# EAGLE design motor_board (EAGLE 6.5.0)
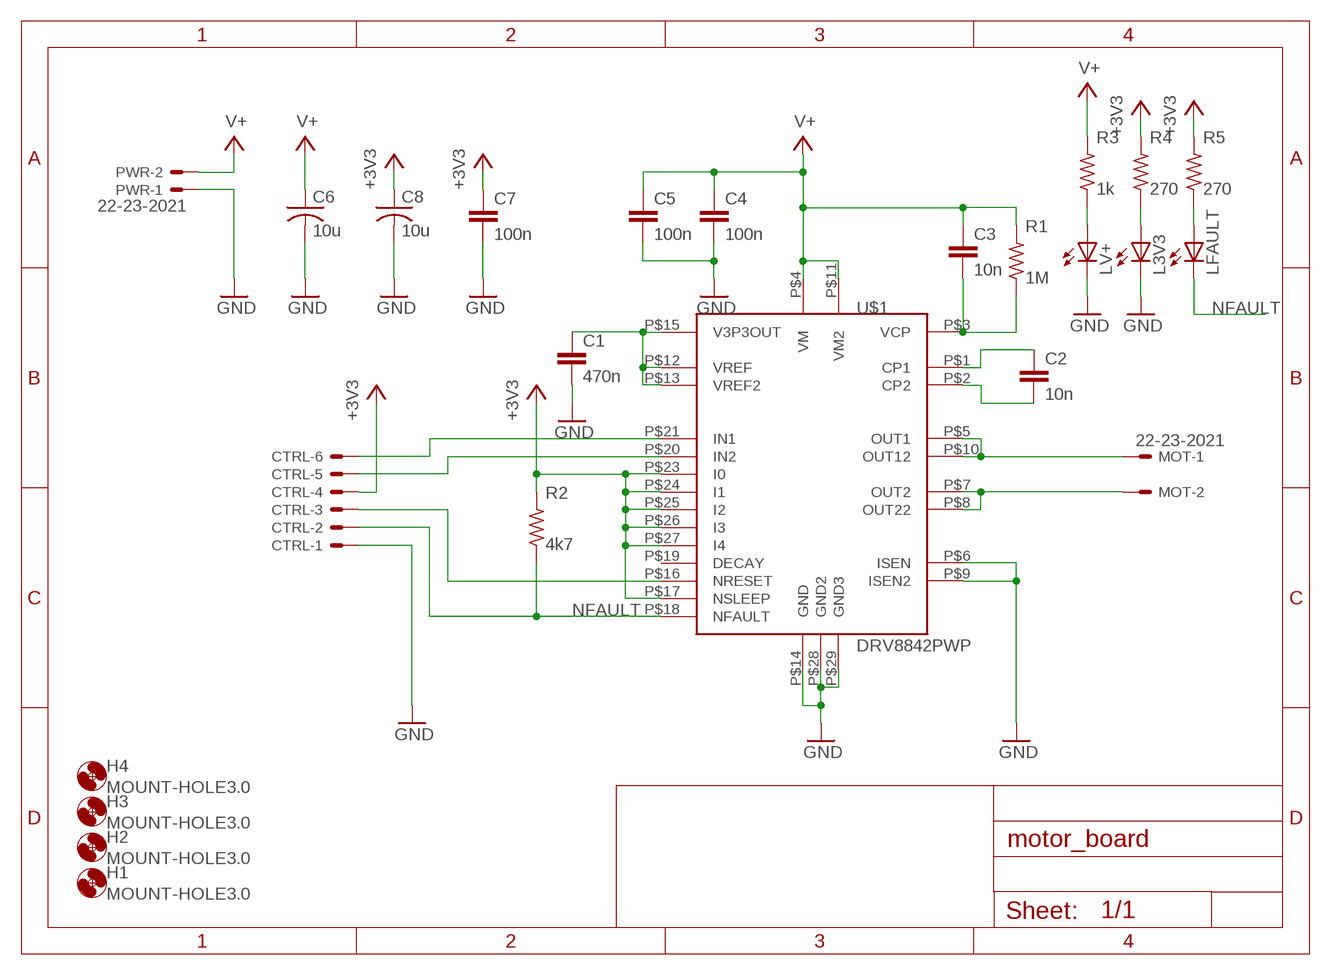
[diagram p0: schematic, sheet 1]

## Parts
C1  470n  C-EUC0603K  [C0603K]
C2  10n  C-EUC0603K  [C0603K]
C3  10n  C-EUC0603K  [C0603K]
C4  100n  C-EUC0603K  [C0603K]
C5  100n  C-EUC0603K  [C0603K]
C6  10u  C-USC0805K  [C0805K]
C7  100n  C-EUC0603K  [C0603K]
C8  10u  C-USC0805K  [C0805K]
CTRL  22-23-2061  [22-23-2061]
H1  MOUNT-HOLE3.0  [3,0]
H2  MOUNT-HOLE3.0  [3,0]
H3  MOUNT-HOLE3.0  [3,0]
H4  MOUNT-HOLE3.0  [3,0]
L3V3  LEDCHIPLED_0603  [CHIPLED_0603]
LFAULT  LEDCHIPLED_0603  [CHIPLED_0603]
LV+  LEDCHIPLED_0603  [CHIPLED_0603]
MOT  22-23-2021  [22-23-2021]
PWR  22-23-2021  [22-23-2021]
R1  1M  R-US_R0603  [R0603]
R2  4k7  R-US_R0603  [R0603]
R3  1k  R-US_R0603  [R0603]
R4  270  R-US_R0603  [R0603]
R5  270  R-US_R0603  [R0603]
U$1  DRV8842PWP  [R-PDS0-G28]

## Nets
+3V3: C7.1 C8.1 CTRL.4 R2.2 R4.2 R5.2 U$1.P$17(NSLEEP) U$1.P$23(I0) U$1.P$24(I1) U$1.P$25(I2) U$1.P$26(I3) U$1.P$27(I4)
CP1: C2.1 U$1.P$1(CP1)
CP2: C2.2 U$1.P$2(CP2)
GND: C1.2 C4.2 C5.2 C6.2 C7.2 C8.2 CTRL.1 L3V3.C LV+.C PWR.1 U$1.P$6(ISEN) U$1.P$9(ISEN2) U$1.P$14(GND) U$1.P$28(GND2) U$1.P$29(GND3)
IN1: CTRL.6 U$1.P$21(IN1)
IN2: CTRL.5 U$1.P$20(IN2)
N$1: L3V3.A R4.1
N$2: LV+.A R3.1
N$3: LFAULT.A R5.1
N$6: C1.1 U$1.P$12(VREF) U$1.P$13(VREF2) U$1.P$15(V3P3OUT)
NFAULT: CTRL.2 LFAULT.C R2.1 U$1.P$18(NFAULT)
NRESET: CTRL.3 U$1.P$16(NRESET)
OUT1: MOT.1 U$1.P$5(OUT1) U$1.P$10(OUT12)
OUT2: MOT.2 U$1.P$7(OUT2) U$1.P$8(OUT22)
V+: C3.1 C4.1 C5.1 C6.1 PWR.2 R1.2 R3.2 U$1.P$4(VM) U$1.P$11(VM2)
VCP: C3.2 R1.1 U$1.P$3(VCP)
Unconnected: U$1.P$19(DECAY)

## Library data of the parts
C1-C5 C7 = rcl:C-EU: CAPACITOR, European symbol
C6 C8 = rcl:C-US: CAPACITOR, American symbol
CTRL = con-molex:22-23-2061: .100" (2.54mm) Center Header - 6 Pin; MF: MOLEX; MPN: 22-23-2061; OC_FARNELL: 1462922; OC_NEWARK: 27C1933
H1-H4 = holes:MOUNT-HOLE: MOUNTING HOLE with drill center marker
L3V3 LFAULT LV+ = led:LED: LED OSRAM: - CHIPLED LG R971, LG N971, LY N971, LG Q971, LY Q971, LO R971, LY R971 LH N974, LH R974 LS Q976, LO Q976, LY Q976 LO Q996 - Hyper CHIPLED LW Q18S LB Q993, LB Q99A, LB R99A - SideLED LS A670, LO A670, LY A670, LG A670, LP A670 LB A673, LV A673, LT A673, LW A673 LH A674 LY A675 LS A676, LA A676, LO A676, LY A676, LW A676 LS A679, LY A679, LG A679 - Hyper Micro SIDELED® LS Y876, LA Y876, LO Y876, LY Y876 LT Y87S - SmartLED LW L88C, LW L88S LB L89C, LB L89S, LG L890 LS L89K, LO L89K, LY L89K LS L896, LA L896, LO L896, LY L896 - TOPLED LS T670, LO T670, LY T670, LG T670, LP T670 LSG T670, LSP T670, LSY T670, LOP T670, LYG T670 LG T671, LOG T671, LSG T671 LB T673, LV T673, LT T673, LW T673 LH T674 LS T676, LA T676, LO T676, LY T676, LB T676, LH T676, LSB T676, LW T676 LB T67C, LV T67C, LT T67C, LS T67K, LO T67K, LY T67K, LW E67C LS E67B, LA E67B, LO E67B, LY E67B, LB E67C, LV E67C, LT E67C LW T67C LS T679, LY T679, LG T679 LS T770, LO T770, LY T770, LG T770, LP T770 LB T773, LV T773, LT T773, LW T773 LH T774 LS E675, LA E675, LY E675, LS T675 LS T776, LA T776, LO T776, LY T776, LB T776 LHGB T686 LT T68C, LB T68C - Hyper Mini TOPLED® LB M676 - Mini TOPLED Santana® LG M470 LS M47K, LO M47K, LY M47K Source: http://www.osram.convergy.de LUXEON: - LUMILED® LXK2-PW12-R00, LXK2-PW12-S00, LXK2-PW14-U00, LXK2-PW14-V00 LXK2-PM12-R00, LXK2-PM12-S00, LXK2-PM14-U00 LXK2-PE12-Q00, LXK2-PE12-R00, LXK2-PE12-S00, LXK2-PE14-T00, LXK2-PE14-U00 LXK2-PB12-K00, LXK2-PB12-L00, LXK2-PB12-M00, LXK2-PB14-N00, LXK2-PB14-P00, LXK2-PB14-Q00 LXK2-PR12-L00, LXK2-PR12-M00, LXK2-PR14-Q00, LXK2-PR14-R00 LXK2-PD12-Q00, LXK2-PD12-R00, LXK2-PD12-S00 LXK2-PH12-R00, LXK2-PH12-S00 LXK2-PL12-P00, LXK2-PL12-Q00, LXK2-PL12-R00 Source: www.luxeon.com KINGBRIGHT: KA-3528ASYC Source: www.kingbright.com
MOT PWR = con-molex:22-23-2021: .100" (2.54mm) Center Header - 2 Pin; MF: MOLEX; MPN: 22-23-2021; OC_FARNELL: 1462926; OC_NEWARK: 25C3832
R1-R5 = rcl:R-US_: RESISTOR, American symbol
U$1 = perso:DRV8842PWP

## Board
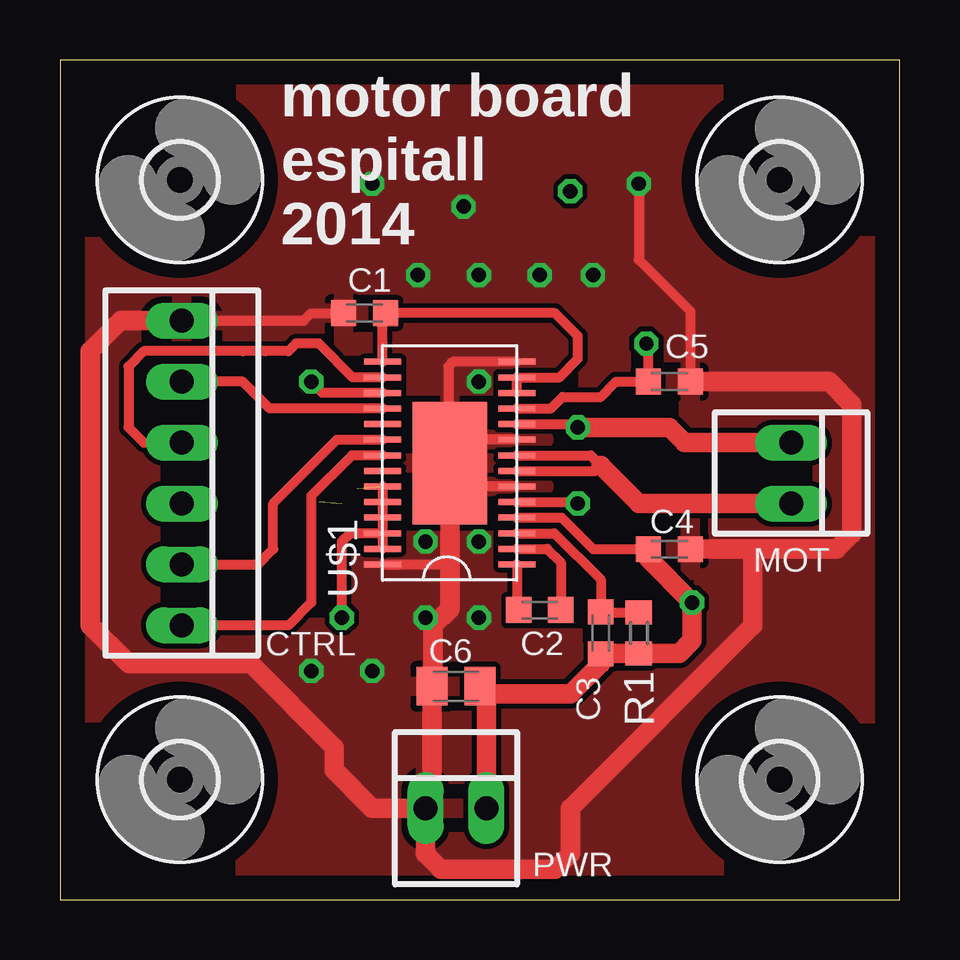
[diagram p1: board, top side]
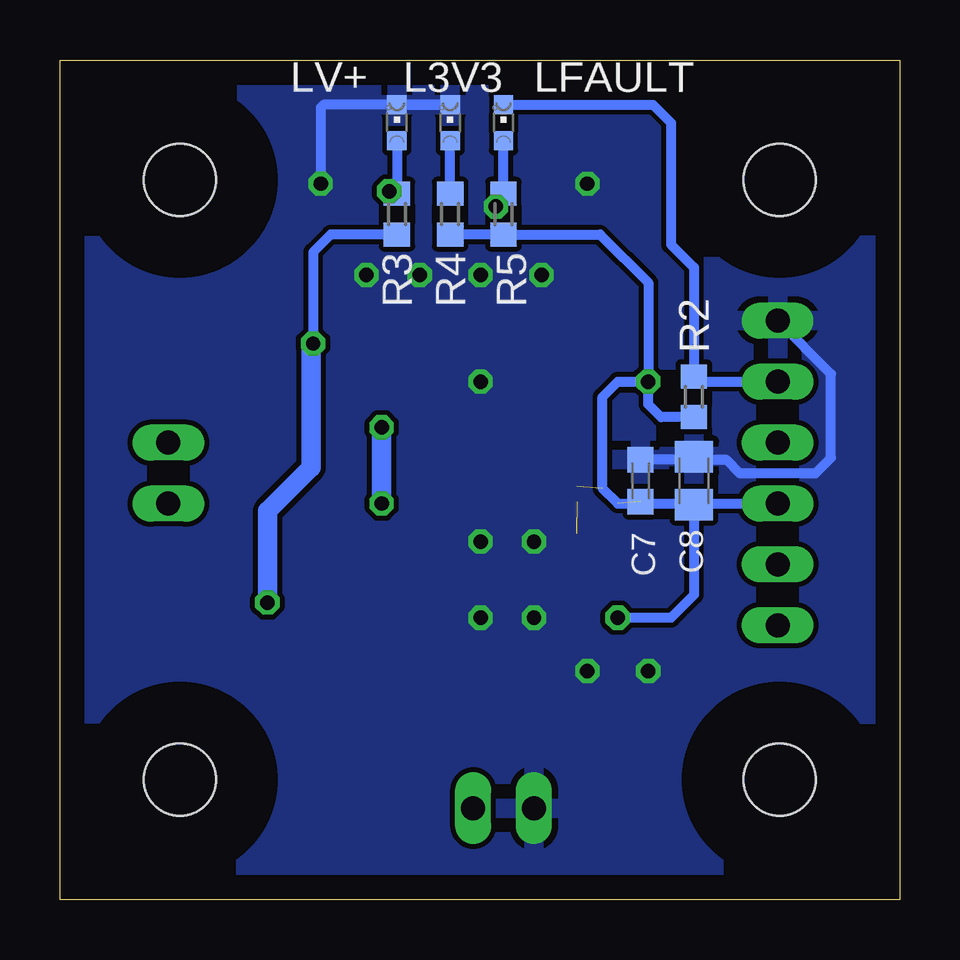
[diagram p2: board, bottom side, seen from below]

Size 35 x 35 mm. Coordinates in mm from the lower left corner, seen from the top.
Outline: 0,0 35,0 35,35 0,35 0,0
Copper layers (1*16): Top 0.035mm / dielectric 1.5mm / Bottom 0.035mm
Design rules "default": minimum track width 10mil, minimum drill 24mil, track to track 8mil, track to pad 8mil, pad to pad 8mil, via to via 8mil, smd to smd 8mil, copper to edge 40mil, drill to drill 8mil, minimum pad ring 10mil, minimum via ring 8mil, stop-mask expansion 4mil, vias tented up to drill 0mil, thermal gap 10mil

### Footprints (pad centres in the part's own frame; a part is rotated, then mirrored left to right if it is on the bottom)
C0603K = smd 1.05 x 1.08: 1 -0.875,0; 2 0.875,0
C0805K = smd 1.3 x 1.6: 1 -1,0; 2 1,0
22-23-2061 = drill 1 long: 1 -6.35,0; 2 -3.81,0; 3 -1.27,0; 4 1.27,0; 5 3.81,0; 6 6.35,0
3,0 = hole 3: 0,0
CHIPLED_0603 = smd 0.8 x 0.8: A 0,-0.75; C 0,0.75
22-23-2021 = drill 1 long: 1 -1.27,0; 2 1.27,0
R0603 = smd 1 x 1.1: 1 -0.85,0; 2 0.85,0
R-PDS0-G28 = smd 0.25 x 1.55: P$1 -3.81,-2.54; P$2 -3.16,-2.54; P$3 -2.51,-2.54; P$4 -1.86,-2.54; P$5 -1.21,-2.54; P$6 -0.56,-2.54; P$7 0.09,-2.54; P$8 0.74,-2.54; P$9 1.39,-2.54; P$10 2.04,-2.54; P$11 2.69,-2.54; P$12 3.34,-2.54; P$13 3.99,-2.54; P$14 4.64,-2.54; P$15 4.64,3.06; P$16 3.99,3.06; P$17 3.34,3.06; P$18 2.69,3.06; P$19 2.04,3.06; P$20 1.39,3.06; P$21 0.74,3.06; P$22 0.09,3.06; P$23 -0.56,3.06; P$24 -1.21,3.06; P$25 -1.86,3.06; P$26 -2.51,3.06; P$27 -3.16,3.06; P$28 -3.81,3.06 | smd 5.1 x 3.1: P$29 0.415,0.26

### Placement (x,y rotation side)
C1  12.7,24.45 180 top
C2  20,12.06 0 top
C3  22.54,11.11 90 top
C4  25.4,14.61 0 top
C5  25.4,21.59 0 top
C6  16.51,8.89 180 top
C7  10.79,17.46 90 bottom
C8  8.57,17.46 90 bottom
CTRL  5.08,17.78 270 top
H1  30,30 0 top
H2  30,5 0 top
H3  5,30 0 top
H4  5,5 0 top
L3V3  18.73,32.38 0 bottom
LFAULT  16.51,32.38 0 bottom
LV+  20.95,32.38 0 bottom
MOT  30.48,17.78 270 top
PWR  16.51,3.81 0 top
R1  24.13,11.11 270 top
R2  8.57,20.95 270 bottom
R3  20.95,28.57 270 bottom
R4  18.73,28.57 270 bottom
R5  16.51,28.57 270 bottom
U$1  16.51,17.78 90 top

### Tracks (layer width: path | path; a pad name or v marks a point on that pad's centre or on a via)
+3V3  (via drill 0.6)  (4 unrouted)
  Top 0.406: U$1.P$17 10.95,21.12 v10.48,21.59 | U$1.P$23 U$1.P$26 | U$1.P$26 U$1.P$27 | U$1.P$26 12.1,15.27 11.75,14.92 v11.75,11.75
  Bottom 0.406: CTRL.4 11.75,16.51 12.38,17.14 12.38,20.95 11.75,21.59 v10.48,21.59 | R2.2 9.95,20.11 10.48,20.64 v10.48,21.59 | C8.1 8.57,12.7 9.53,11.75 v11.75,11.75 | v10.48,21.59 10.48,25.72 12.48,27.73 R5.2 R4.2
CP1
  Top 0.406: U$1.P$1 19.05,12.14 C2.1
CP2
  Top 0.406: U$1.P$2 20.3,14.62 20.88,14.05 C2.2
GND  (via drill 0.6)
  Top 0.406: U$1.P$9 17.23,19.17 U$1.P$29 | U$1.P$6 17.23,17.22 U$1.P$29 | U$1.P$28 16.25,13.97 16.25,13.65 | CTRL.1 10.16,24.13 10.48,24.45 C1.2 | U$1.P$14 16.39,22.42 16.19,22.23 16.19,18.25 U$1.P$29 | v24.13,29.84 24.13,26.67 26.27,24.52 C5.2
  Top 0.813: PWR.1 15.51,4.08 C6.2 15.56,8.94 15.56,11.43 16.25,12.12 16.25,13.65 U$1.P$29 | C5.2 32.07,21.59 33.02,20.64 33.02,15.24 32.38,14.61 28.89,14.61 | 28.89,14.61 C4.2 | CTRL.1 2.54,24.13 1.27,22.86 1.27,11.43 2.86,9.84 7.94,9.84 11.43,6.35 11.43,5.4 13.02,3.81 PWR.1 | PWR.1 15.24,1.91 15.88,1.27 20.64,1.27 21.27,1.91 21.27,3.81 28.89,11.43 28.89,14.61
  Bottom 0.406: 8.7,18.34 C8.2 | 8.7,18.34 7.22,18.34 6.67,17.78 3.49,17.78 2.86,18.41 2.86,21.91 CTRL.1 | 8.7,18.34 C7.2 | LV+.C L3V3.C 24.02,33.13 24.13,33.02 v24.13,29.84
  other vias: 10.48,9.53 13.02,9.53 15.24,11.75 17.46,11.75 15.24,14.92 17.46,14.92 16.83,28.89 17.46,21.59 14.92,26.04 17.46,26.04 20,26.04 22.23,26.04 13.02,29.84
  pour Top: 0,0 34.92,0 34.92,34.92 0,34.92 0,34.61
  pour Bottom: -0.64,-0.95 36.2,-0.95 36.2,36.2 -0.95,36.2
IN1
  Top 0.406: U$1.P$21 12.17,18.52 10.48,16.83 10.48,12.38 9.53,11.43 CTRL.6
IN2
  Top 0.406: CTRL.5 8.26,13.97 8.89,14.61 8.89,16.51 11.55,19.17 U$1.P$20
N$1
  Bottom 0.406: R4.1 L3V3.A
N$2
  Bottom 0.406: LV+.A R3.1
N$3
  Bottom 0.406: R5.1 LFAULT.A
N$6
  Top 0.406: U$1.P$15 13.45,24.32 C1.1 20.64,24.45 21.59,23.5 21.59,22.54 20.82,21.77 U$1.P$13 U$1.P$12
N$18  (via drill 0.6)
  other vias: 21.27,29.53
NFAULT
  Top 0.406: U$1.P$18 8.74,20.47 7.62,21.59 CTRL.2
  Bottom 0.406: 6.99,21.59 CTRL.2 8.36,21.59 R2.1 8.57,26.35 9.53,27.3 9.53,32.38 10.28,33.13 LFAULT.C
NRESET
  Top 0.406: CTRL.3 3.49,19.05 2.86,19.68 2.86,22.23 3.49,22.86 7.62,22.86 8.57,22.86 9.53,22.86 9.84,23.18 10.79,23.18 12.2,21.77 U$1.P$16
OUT1  (via drill 0.6)
  Top 0.406: U$1.P$10 21.45,19.82 v21.59,19.68 | U$1.P$5 21.53,16.57
  Top 0.813: MOT.1 26.04,19.05 25.4,19.68 v21.59,19.68 | 21.53,16.57 v21.59,16.51
  Bottom 0.406: v21.59,19.68 21.59,19.82
  Bottom 0.813: v21.59,19.68 v21.59,16.51
OUT2
  Top 0.406: U$1.P$7 22.32,17.87 22.54,18.1 22.12,18.52 U$1.P$8
  Top 0.813: MOT.2 24.13,16.51 22.54,18.1
V+  (via drill 0.6)
  Top 0.406: U$1.P$4 20.91,15.92 22.23,14.61 C4.1 | U$1.P$11 20.47,20.47 20.95,20.95 22.54,20.95 23.18,21.59 C5.1 24.52,23.1 v24.45,23.18
  Top 0.813: PWR.2 17.78,8.62 | 17.78,8.62 C6.1 | 17.78,8.62 17.83,8.57 21.27,8.57 22.54,9.84 C3.1 22.57,10.26 R1.2 25.82,10.26 26.35,10.79 v26.35,12.38 24.52,14.21 C4.1
  Bottom 0.406: 24.52,23.1 v24.45,23.18 24.45,26.99 23.71,27.73 R3.2
  Bottom 0.813: v26.35,12.38 26.35,16.19 24.52,18.02 24.52,23.1
VCP
  Top 0.406: U$1.P$3 20.61,15.27 22.54,13.34 C3.2 22.57,11.96 R1.1

### Text on the board
tPlace: motor board / espitall / 2014